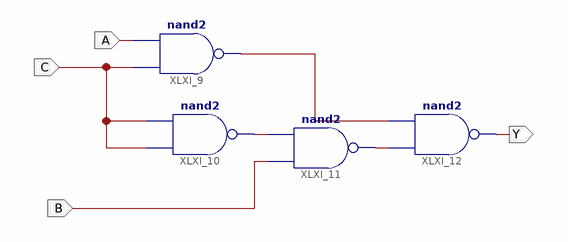
[diagram p0: schematic sheet 1]
// Xilinx ISE schematic MAJORITY.sch (spartan6) as structural Verilog: 4 symbols, 4 ports
module MAJORITY (
  input  C,
  input  B,
  input  A,
  output Y
);

  wire XLXN_25, XLXN_26, XLXN_27;

  nand XLXI_9 (XLXN_27, C, A);
  nand XLXI_10 (XLXN_25, C, C);
  nand XLXI_11 (XLXN_26, B, XLXN_25);
  nand XLXI_12 (Y, XLXN_26, XLXN_27);
endmodule
